# Altium schematic sheet PJ30072S6_3V3_BOOST.SchDoc
size A3; SheetNumber: 7; SheetTotal: 7
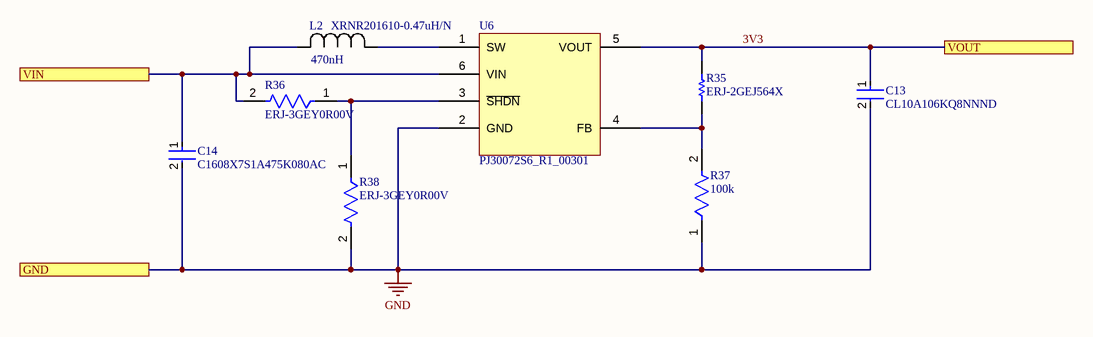
[diagram p0: PJ30072S6_3V3_BOOST.SchDoc]

## Parts
C13  CL10A106KQ8NNND  [FP-CL10-IPC_C]
C14  C1608X7S1A475K080AC  [FP-C1608-080-IPC_B]
L2  XRNR201610-0.47uH/N  Inductance: 470nH  [XRNR201610-0.47uH/N]
R35  ERJ-2GEJ564X  [RESC1005X40X25NL05T05]
R36  ERJ-3GEY0R00V  [FP-ERJ-3GEY0R00V-MFG]
R37  Resistance: 100k  [FP-CRCW0402-e3-IPC_B]  (hidden comment: CRCW0402100KFKED)
R38  ERJ-3GEY0R00V  [FP-ERJ-3GEY0R00V-MFG]
U6  PJ30072S6_R1_00301  [SOT95P280X15-6N]

## Ports
GND, VIN, VOUT

## Nets
GND: C13.2 C14.2 R37.1 R38.2 U6.2(GND) ; port GND
3V3: C13.1 R35.2 U6.5(VOUT) ; port VOUT
VIN: C14.1 L2.2 R36.2 U6.6(VIN) ; port VIN
NetL2_1: L2.1 U6.1(SW)
NetR35_1: R35.1 R37.2 U6.4(FB)
NetR36_1: R36.1 R38.1 U6.3(~{SHDN})

## Notes on the sheet
- Sheet Title
- PCB Project Name
- Modified
- Sheet
- of

## Library data of the parts
C13 = CMP-13271-003243-1: Cap Ceramic 10uF 6.3V X5R ±10% Pad SMD 0603 +85°C T/R; Packaging: Tape and Reel; Width: 0.031inch; Radiation Hardening: No; Dielectric: X5R; Height: 0.8mm; Tolerance: 10%; Capacitance: 10uF; Voltage Rating (DC): 6.3V; Min Operating Temperature: -55°C; Depth: 0.8mm; Thickness: 0.035inch; Length: 1.6mm; Voltage Rating: 6.3V; Package Quantity: 10000; Max Operating Temperature: 85°C; Case/Package: 0603; Mount: Surface Mount
C14 = CMP-08246-005491-1: CAP CER 4.7UF 10V X7S 0603; Dielectric Material: Ceramic; Interface: I2C; Frequency: 48MHz; Memory Type: FLASH; Peripherals: Brown-out Detect/Reset; Tolerance: 10%; Oscillator Type: Internal; Number of I/Os: 53; Core Architecture: ARM; Memory Size: 64KB; Voltage Rating: 10V; Lead Free: Lead Free; Case Code (Imperial): 0603; Voltage Rating (DC): 10V; Series: Leopard Gecko; Min Operating Temperature: -40°C; Case/Package: LFBGA; Dielectric: X7S; RoHS Compliant: Yes; Package Quantity: 1000; Capacitance: 4.7uF; Thickness: 800um; Number of Pins: 64; REACH SVHC: No SVHC; Length: 1.6mm; Max Operating Temperature: 125°C; Depth: 0.8mm; Packaging: Tape and Reel; Case Code (Metric): 1608
L2 = XRNR201610-0.47uH/N: 2.35A 2.3A 470nH 59mΩ Magnetic Shielded Inductor ±30% SMD-2P,2x1.6mm Power Inductors ROHS; Manufacturer: Inpaq; Manufacturer Part Number: WIP252012S-1R5MLDG; Supplier: Digikey; Supplier Part Number: 3526-WIP252012S-1R5MLDGCT-ND; RoHS: No; Category: Fixed Inductors
R35 = CMP-2002-00560-1: Manufacturer: Panasonic; Part Number: ERJ-2GEJ564X
R36 R38 = CMP-2000-00700-2: RES SMD 0 OHM JUMPER 1/10W 0603; Manufacturer: Panasonic; Tolerance: 5%; Description: 0 Ohms Jumper 0.1W, 1/10W Chip Resistor 0603 (1608 Metric) Automotive AEC-Q200 Thick Film; Automotive Grade: Grade 0; Voltage Rating: 75V; Value: 0Ω; Temperature Coefficient: -100/+600ppm/°C; Power Rating: 0.1W; Mouser Description: Resistor, Chip Thick Film, 0 Ohm, 0.1w, Resistor, Chip Thick Film, 0 Ohm, 0.1w, 5%; Manufacturer Part Number: ERJ-3GEY0R00V; Ipc Land Pattern Name: RESC16080X45; Category: Res; Package: 0603; Temperature: -55°C to +155°C; Temperature Range Low: -55°C; Series: ERJ; Resistance: 0Ω; RoHS: TRUE; Composition: Thick Film; Octopart: https://octopart.com/erj-3gey0r00v-panasonic-55389238; Device Class L1: Passive Components; Footprint Url: https://industrial.panasonic.com/cdbs/www-data/pdf/RDA0000/DMA0000COL17.pdf; ComponentLink2Description: Datasheet; Device Class L2: Resistors; Temperature Range High: +155°C; Digikey Description: RES SMD 0 OHM JUMPER 1/10W 0603; Lead Free: Yes; Device Class L3: Chip SMD Resistors; Height: 0.55mm; ComponentLink2URL: https://industrial.panasonic.com/cdbs/www-data/pdf/RDA0000/AOA0000C301.pdf; Automotive: Yes
R37 = CMP-2002-08123-3: RES Thick Film, 100kΩ, 1%, 0.063W, 100ppm/°C, 0402; Power Rating: 63mW; Voltage Rating (DC): 50V; Lead Free: Lead Free; Height: 0.35mm; Contact Plating: Tin; Min Operating Temperature: -55°C; Package Quantity: 10000; Case/Package: 0402; Temperature Coefficient: 100ppm/°C; Number of Terminations: 2; Packaging: Tape and Reel; Max Power Dissipation: 63mW; Case Code (Metric): 1005; Mount: Surface Mount; Width: 0.02inch; Termination: SMD/SMT; Length: 1mm; Number of Pins: 2; Weight: 2.3E-05oz; Radiation Hardening: No; Tolerance: 1%; Military Standard: Not; Features: Automotive AEC-Q200; Depth: 0.5mm; Composition: Thick Film; Max Operating Temperature: 155°C; Voltage Rating: 50V; Case Code (Imperial): 0402
U6 = PJ30072S6_R1_00301: IC REG BOOST ADJ SOT23-6; Supplier 1: Mouser; Supplier Part Number 1: 241-PJ30072S6R100301